# Altium schematic sheet FMC_SINGLE_LPC_RUGGEDIZED.SchDoc: Connector (LPC), Ruggedized mounting
size A4; Date: 12.07.2017; DrawnBy: PFH; Engineer: PFH; DocumentNumber: 1; Revision: A; SheetNumber: 1; SheetTotal: 1; Projekt: FMC module (single width), Low pin count; Website: www.fmchub.com; ProjectName: FMC_Single_LPC_Commercial
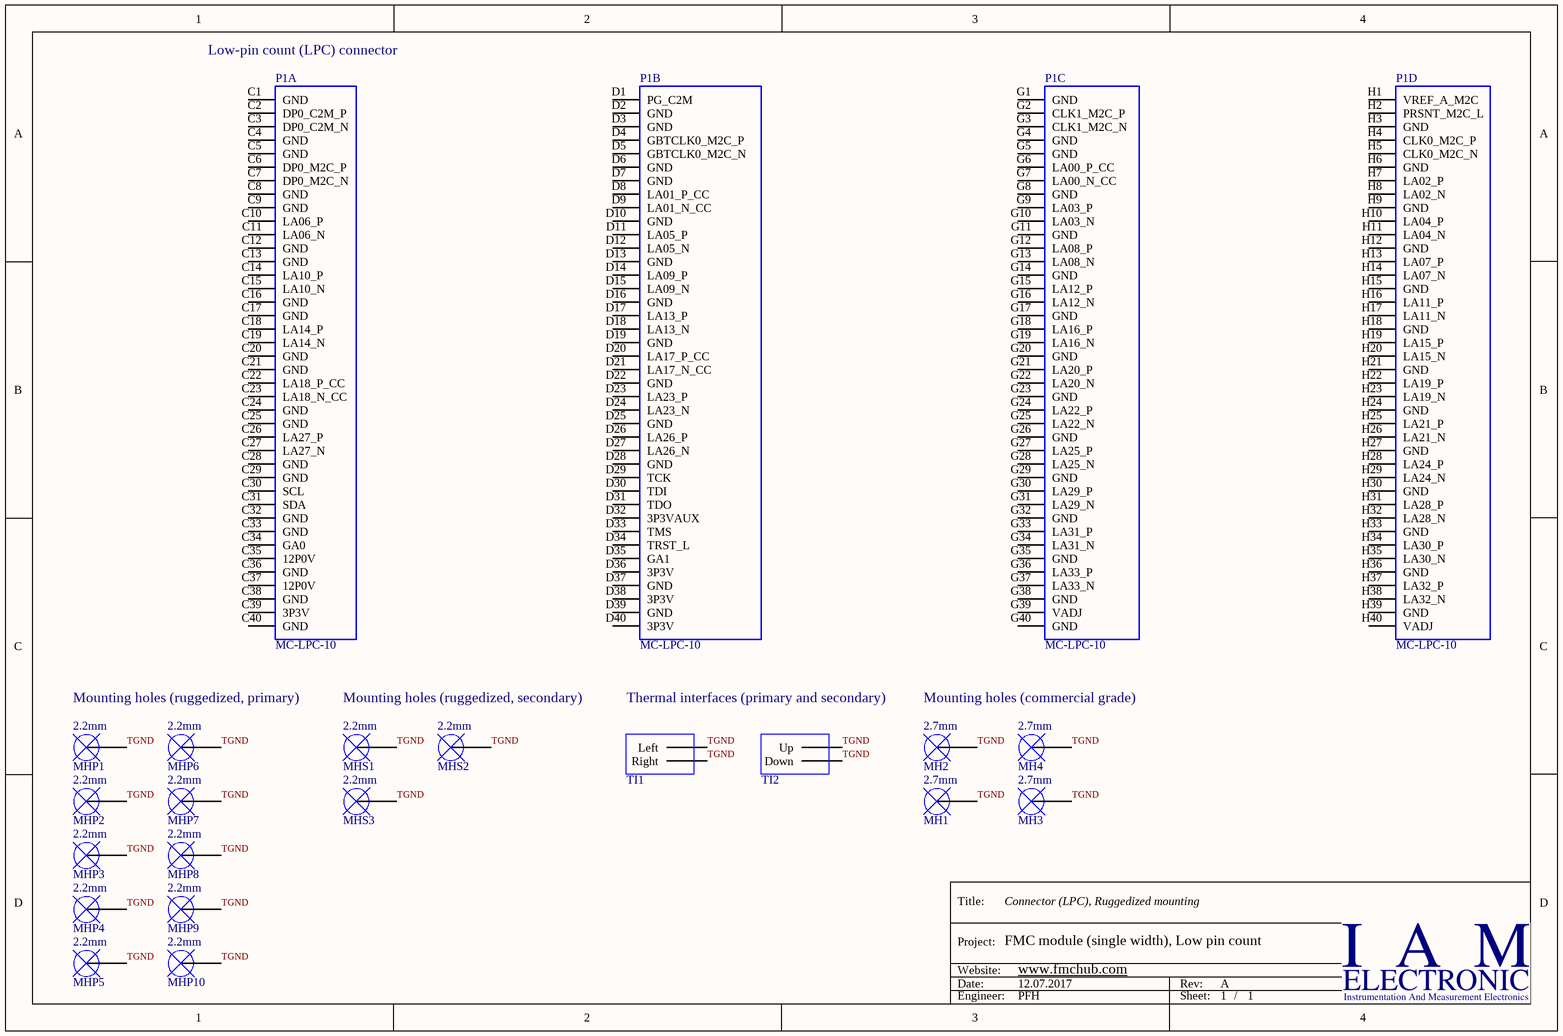
[diagram p0: FMC_SINGLE_LPC_RUGGEDIZED.SchDoc]

## Parts
MH1  2.7mm  [Mounting_Hole_Plated_2.7mm - d3.1mm]  (no BOM)
MH2  2.7mm  [Mounting_Hole_Plated_2.7mm - d3.1mm]  (no BOM)
MH3  2.7mm  [Mounting_Hole_Plated_2.7mm-COVERED]  (no BOM)
MH4  2.7mm  [Mounting_Hole_Plated_2.7mm-COVERED]  (no BOM)
MHP1  2.2mm  [Mounting_Hole_PLATED_2.2mm]  (no BOM)
MHP2  2.2mm  [Mounting_Hole_PLATED_2.2mm]  (no BOM)
MHP3  2.2mm  [Mounting_Hole_PLATED_2.2mm]  (no BOM)
MHP4  2.2mm  [Mounting_Hole_PLATED_2.2mm]  (no BOM)
MHP5  2.2mm  [Mounting_Hole_PLATED_2.2mm]  (no BOM)
MHP6  2.2mm  [Mounting_Hole_PLATED_2.2mm]  (no BOM)
MHP7  2.2mm  [Mounting_Hole_PLATED_2.2mm]  (no BOM)
MHP8  2.2mm  [Mounting_Hole_PLATED_2.2mm]  (no BOM)
MHP9  2.2mm  [Mounting_Hole_PLATED_2.2mm]  (no BOM)
MHP10  2.2mm  [Mounting_Hole_PLATED_2.2mm]  (no BOM)
MHS1  2.2mm  [Mounting_Hole_PLATED_2.2mm]  (no BOM)
MHS2  2.2mm  [Mounting_Hole_PLATED_2.2mm]  (no BOM)
MHS3  2.2mm  [Mounting_Hole_PLATED_2.2mm]  (no BOM)
P1  MC-LPC-10  [ASP-134604-01]  (parts A,B,C,D of 4)
TI1  Primary Thermal Interface  [Primary_Thermal_Interface]  (value not drawn)  (no BOM)
TI2  Secondary Thermal Interface  [Secondary_Thermal_Interface]  (value not drawn)  (no BOM)

## Nets
TGND: MH1.0 MH2.0 MH3.0 MH4.0 MHP1.0 MHP2.0 MHP3.0 MHP4.0 MHP5.0 MHP6.0 MHP7.0 MHP8.0 MHP9.0 MHP10.0 MHS1.0 MHS2.0 MHS3.0 TI1.0(Left) TI1.1(Right) TI2.0(Up) TI2.1(Down)

Not connected (* = marked no-connect by the designer): P1 C1(GND) C2(DP0_C2M_P) C3(DP0_C2M_N) C4(GND) C5(GND) C6(DP0_M2C_P) C7(DP0_M2C_N) C8(GND) C9(GND) C10(LA06_P) C11(LA06_N) C12(GND) C13(GND) C14(LA10_P) C15(LA10_N) C16(GND) C17(GND) C18(LA14_P) C19(LA14_N) C20(GND) C21(GND) C22(LA18_P_CC) C23(LA18_N_CC) C24(GND) C25(GND) C26(LA27_P) C27(LA27_N) C28(GND) C29(GND) C30(SCL) C31(SDA) C32(GND) C33(GND) C34(GA0) C35(12P0V) C36(GND) C37(12P0V) C38(GND) C39(3P3V) C40(GND) D1(PG_C2M) D2(GND) D3(GND) D4(GBTCLK0_M2C_P) D5(GBTCLK0_M2C_N) D6(GND) D7(GND) D8(LA01_P_CC) D9(LA01_N_CC) D10(GND) D11(LA05_P) D12(LA05_N) D13(GND) D14(LA09_P) D15(LA09_N) D16(GND) D17(LA13_P) D18(LA13_N) D19(GND) D20(LA17_P_CC) D21(LA17_N_CC) D22(GND) D23(LA23_P) D24(LA23_N) D25(GND) D26(LA26_P) D27(LA26_N) D28(GND) D29(TCK) D30(TDI) D31(TDO) D32(3P3VAUX) D33(TMS) D34(TRST_L) D35(GA1) D36(3P3V) D37(GND) D38(3P3V) D39(GND) D40(3P3V) G1(GND) G2(CLK1_M2C_P) G3(CLK1_M2C_N) G4(GND) G5(GND) G6(LA00_P_CC) G7(LA00_N_CC) G8(GND) G9(LA03_P) G10(LA03_N) G11(GND) G12(LA08_P) G13(LA08_N) G14(GND) G15(LA12_P) G16(LA12_N) G17(GND) G18(LA16_P) G19(LA16_N) G20(GND) G21(LA20_P) G22(LA20_N) G23(GND) G24(LA22_P) G25(LA22_N) G26(GND) G27(LA25_P) G28(LA25_N) G29(GND) G30(LA29_P) G31(LA29_N) G32(GND) G33(LA31_P) G34(LA31_N) G35(GND) G36(LA33_P) G37(LA33_N) G38(GND) G39(VADJ) G40(GND) H1(VREF_A_M2C) H2(PRSNT_M2C_L) H3(GND) H4(CLK0_M2C_P) H5(CLK0_M2C_N) H6(GND) H7(LA02_P) H8(LA02_N) H9(GND) H10(LA04_P) H11(LA04_N) H12(GND) H13(LA07_P) H14(LA07_N) H15(GND) H16(LA11_P) H17(LA11_N) H18(GND) H19(LA15_P) H20(LA15_N) H21(GND) H22(LA19_P) H23(LA19_N) H24(GND) H25(LA21_P) H26(LA21_N) H27(GND) H28(LA24_P) H29(LA24_N) H30(GND) H31(LA28_P) H32(LA28_N) H33(GND) H34(LA30_P) H35(LA30_N) H36(GND) H37(LA32_P) H38(LA32_N) H39(GND) H40(VADJ)

## Notes on the sheet
- (near P1) Low-pin count (LPC) connector
- Mounting holes (ruggedized, primary)
- Mounting holes (ruggedized, secondary)
- Thermal interfaces (primary and secondary)
- Mounting holes (commercial grade)
- Title:
- Project:
- Date:
- Website:
- Rev:
- Engineer:
- Sheet:
- /

## Library data of the parts
MH1-MH4 = Mounting_Hole_2.7mm: Mounting hole, hole size 2.7mm; Hole radius: 2.7 mm; Diameter (plated): *; Keep out (radius): *; Plated: *
MHP1-MHP10 MHS1-MHS3 = Mounting_Hole_2.2mm: Mounting hole, hole size 2.2mm; Hole radius: 2.2 mm; Diameter (plated): *; Keep out (radius): *; Plated: *
P1 = MC-LPC-10: MC-LPC-10, FMC Low-pin count connector, lead free, 160 I/Os, male, 10 mm mated stack height; Manufacturer: Samtec; Manufacturer Ref: SEAM-40-03.5-S-10-2-A-K-TR-VITA57; Pitch: 1.27 mm; Mated Stack Height: 10 mm; Solder Type: Lead-Free; Number I/O: 160; PartName: ASP-134604-01; Part: ASP-134604-01; Vita PartNumber: MC-LPC-10; Pin Count: Low; Gender: male; Supplier 1: Digi-Key; Supplier Part Number 1: SAM8732-ND
TI1 = Primary_Thermal_Interface: Primary Thermal Interface, left and right side
TI2 = Secondary_Thermal_Interface: Secondary Thermal Interface, upper and lower side